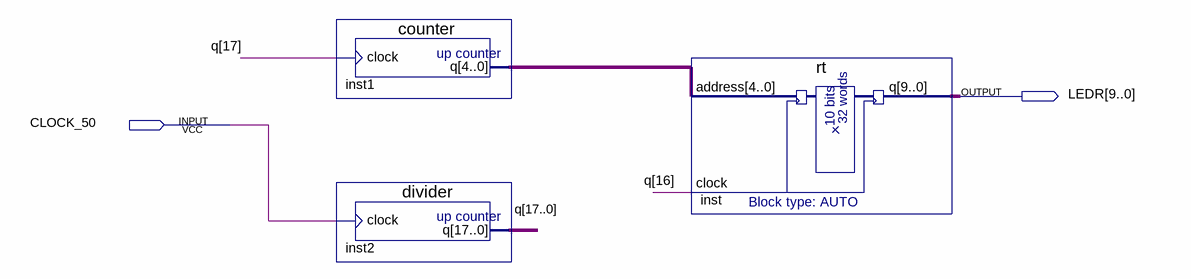
[diagram p0: schematic sheet]
// Quartus schematic Texto_ar.bdf as structural Verilog: 3 symbols, 2 pins
module Texto_ar (
  input  CLOCK_50,
  output [9:0] LEDR
);

  wire [4:0] inst1_q;
  wire [17:0] q;

  counter inst1 (.clock(q[17]), .q(inst1_q));
  divider inst2 (.clock(CLOCK_50), .q(q));
  rt inst (.address(inst1_q), .clock(q[16]), .q(LEDR));
endmodule
